# Altium schematic sheet Receiver.SchDoc
size A4; SheetNumber: 1; SheetTotal: 1
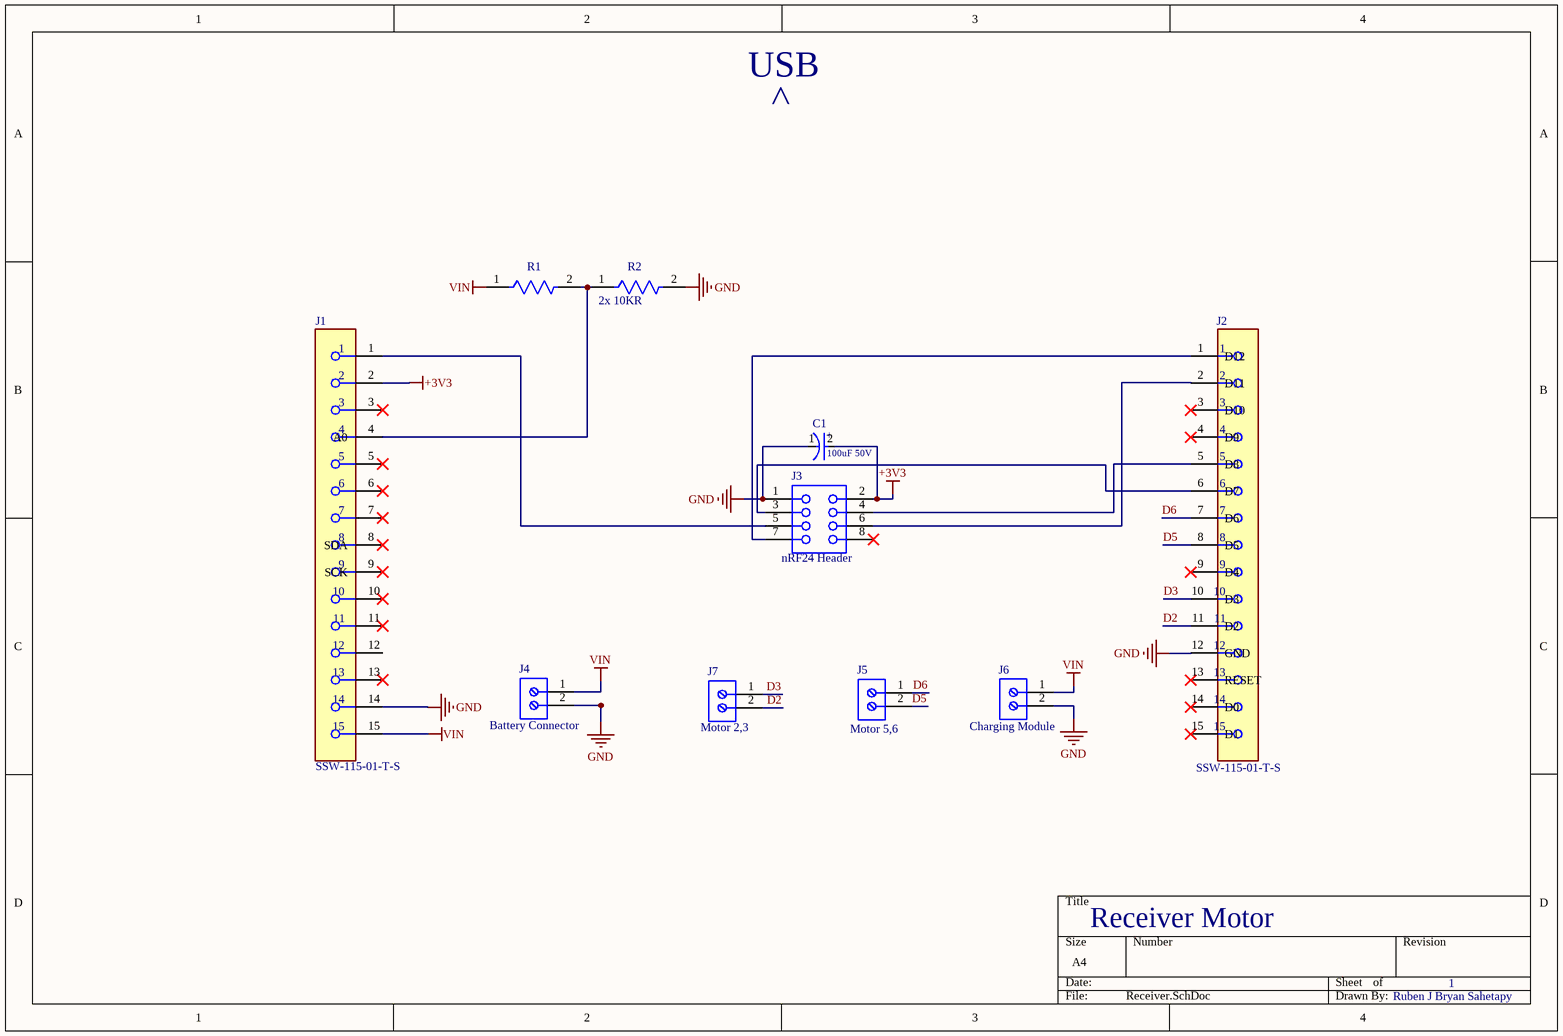
[diagram p0: Receiver.SchDoc]

## Parts
C1  100uF 50V  [FP-EEU-FR1H101B-MFG]
J1  SSW-115-01-T-S  [FP-SSW-115-01-T-S-MFG]
J2  SSW-115-01-T-S  [FP-SSW-115-01-T-S-MFG]
J3  nRF24 Header  [61300821821]
J4  Battery Connector  [691214110002]
J5  Motor 5,6  [691214110002]
J6  Charging Module  [691214110002]
J7  Motor 2,3  [691214110002]
R1  (no value)  [FP-ZOR-25-R-52-0R-MFG]
R2  2x 10KR  [FP-ZOR-25-R-52-0R-MFG]

## Nets
+3V3: C1.2(A) J1.2 J3.2
GND: C1.1(C) J1.14 J2.12(GND) J3.1 J4.2 J6.2 R2.2
VIN: J1.15 J4.1 J6.1 R1.1
D2: J2.11(D2) J7.2
D3: J2.10(D3) J7.1
D5: J2.8(D5) J5.2
D6: J2.7(D6) J5.1
NetJ1_1: J1.1 J3.5
NetJ1_4: J1.4(A0) R1.2 R2.1
NetJ2_1: J2.1(D12) J3.7
NetJ2_2: J2.2(D11) J3.6
NetJ2_5: J2.5(D8) J3.4
NetJ2_6: J2.6(D7) J3.3

Not connected (* = marked no-connect by the designer): J1 3* 5* 6* 7* 8(SDA)* 9(SCK)* 10* 11* 12 13*; J2 3(D10)* 4(D9)* 9(D4)* 13(RESET)* 14(D0)* 15(D1)*; J3 8*

## Notes on the sheet
- USB
- >
- Receiver Motor
- 1
- Ruben J Bryan Sahetapy
- (in symbol CMP-05427-000020-1) +

## Library data of the parts
C1 = CMP-05427-000020-1: CAP ALUM 100UF 20% 50V RADIAL; Life (Hours): 6000Hour; Ripple Current: 870mA; Lead Diameter: 0.6mm; Impedance: 61mR; Tolerance: 20%; Mount: Through Hole; Lead Free: Lead Free; Length: 11.5mm; Height - Seated (Max): 0.512inch; Contact Plating: Tin; Termination: Radial; Series: FR; Max Operating Temperature: 105°C; Features: General Purpose; Min Operating Temperature: -40°C; RoHS Compliant: Yes; Height: 11.5mm; Voltage Rating (DC): 50V; Diameter: 8mm; Capacitance: 100uF; Lead Pitch: 5mm; Radiation Hardening: No; Package Quantity: 1; Case/Package: Radial; Voltage Rating: 50V; Packaging: Tape and Reel; ESR (Equivalent Series Resistance): 61mR; REACH SVHC: No SVHC
J1 J2 = CMP-02766-001723-1: CONN RCPT 15POS 0.1 TIN PCB; Connector Type: Receptacle; Max Voltage Rating (AC): 550V; Mating Cycles: 100; Number of Positions: 15; Pitch: 0.1inch; Max Current Rating: 6.9A; Contact Resistance: 10mR; Contact Type: Female Socket; Color: Black; Depth: 2.41mm; Radiation Hardening: No; Orientation: Straight; Termination: Solder; Series: SSW; Lead Free: Lead Free; Min Operating Temperature: -55°C; Contact Plating: Tin; Contact Material: Bronze; Max Operating Temperature: 105°C; Mount: Through Hole; Packaging: Bulk; Gender: Receptacle; Housing Material: Polymer; RoHS Compliant: Yes; Length: 38.61mm; Number of Rows: 1; REACH SVHC: No SVHC; Width: 2.41mm; Number of Contacts: 15; Housing Color: Black
J3 = CMP-1502-01329-3: NexarPartId: 61924725; Operating Supply Voltage: 250V; Contact Resistance: 20mΩ; Gender: Female; Current Rating: 3A; RoHS: Non-Compliant; Lead Pitch: 2.54mm; Number of Pins: 8; Orientation: Vertical
J4-J7 = CMP-1502-02464-2: NexarPartId: 18818288; Plating: Brass, Steel; Current: 10A; Pitch: 3.5052mm; Number of Levels: 1; Number of Contacts: 2; Wire Gauge (Min): 16AWG; Voltage: 300V; Wire Gauge (Max): 24AWG; Stripping Length: -6mm; Number of Pins: 2; Number of Rows: 1; REACH SVHC: Unknown; RoHS: Compliant; Housing Material: Nylon; Termination: Screw; Mount: Through Hole; Contact Plating: Brass, Tin; Number of Positions Per Level: 2; Color: Blue, Green; Width: 7.9mm; Voltage Rating: 300V; Length: 7.4mm; Current Rating: 10A; Wire/Cable Gauge: 24AWG; Packaging: Box; Max Operating Temperature: 105°C; Lead Pitch: 3.5mm; Height: 8.7mm; Contact Material: Brass; Min Operating Temperature: -40°C
R1 R2 = CMP-03413-000010-1: RES 0 OHM JUMPER 1/4W AXIAL; Temperature Coefficient: 100ppm/°C; Max Power Dissipation: 250mW; Tolerance: 5%; Resistance: 0mR; Case/Package: Axial; Termination: Axial; Series: ZOR; Lead Free: Lead Free; Length: 0.248inch; Military Standard: Not; RoHS Compliant: Yes; Min Operating Temperature: -55°C; Packaging: Tape and Reel; Resistor Type: Carbon Film; Construction: Cylindrical; Package Quantity: 5000; Max Operating Temperature: 155°C; Number of Terminations: 2; Power Rating: 250mW